# Altium project ReRAM_Board.PrjPcb
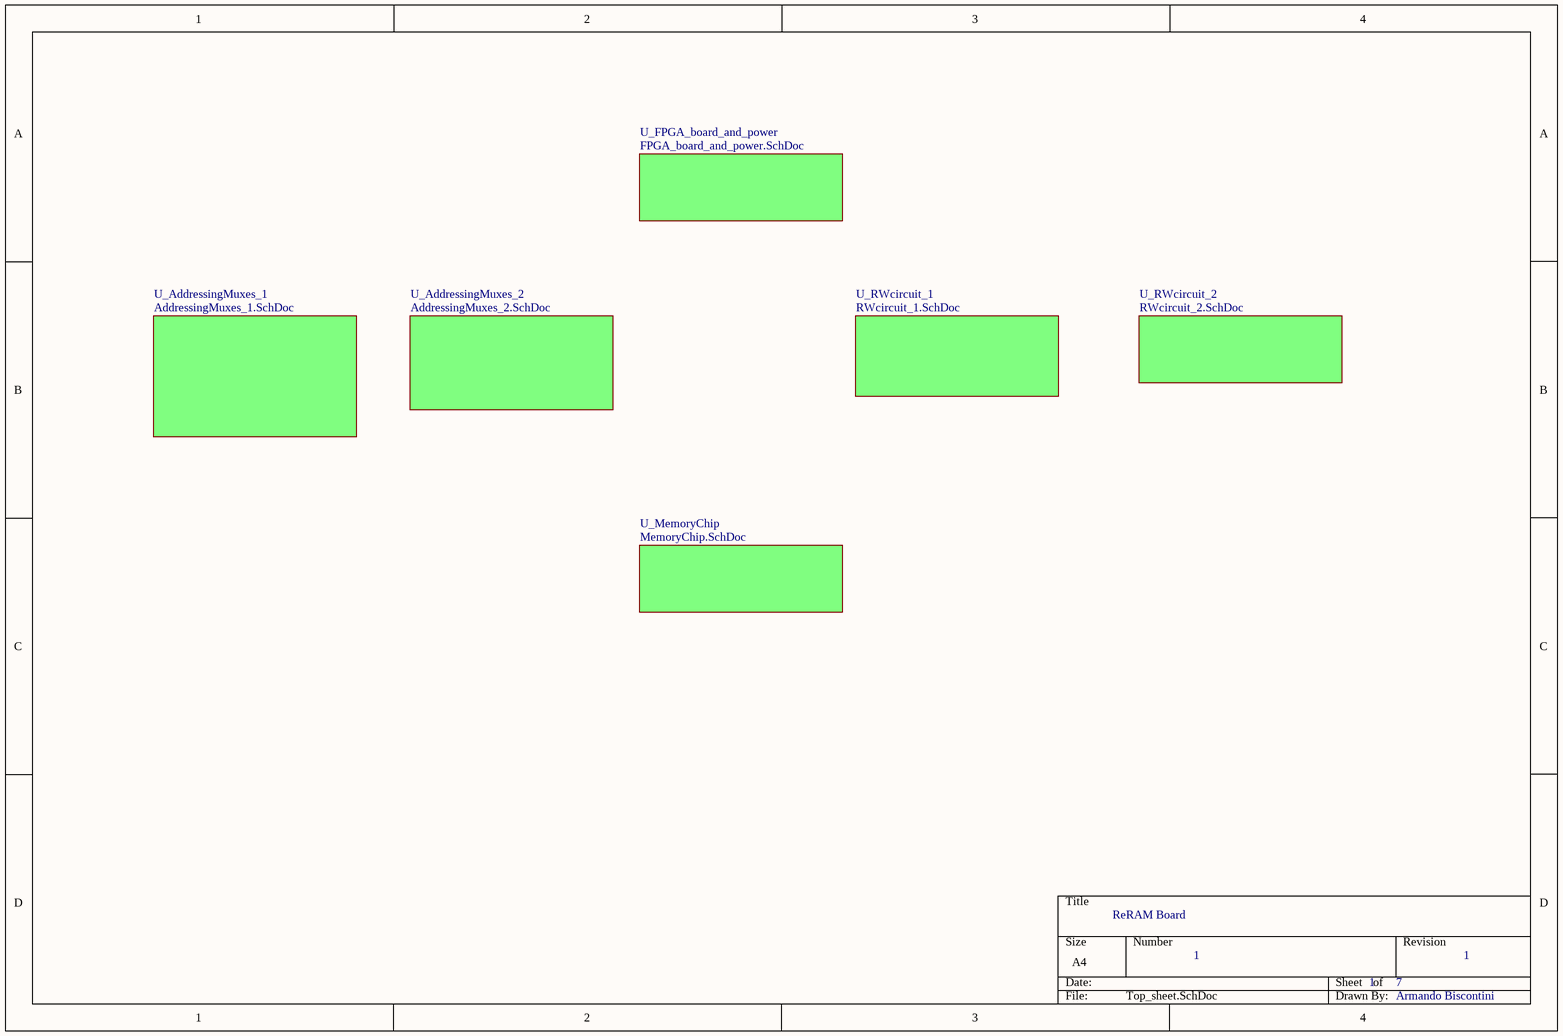
[diagram p0: Top_sheet.SchDoc]
7 sheets, 123 parts. Net scope: flat (ports and power ports of the same name join across sheets).
Board file: PCB1.PcbDoc
Sheets:
  Top_sheet.SchDoc
    U_FPGA_board_and_power = FPGA_board_and_power.SchDoc
    U_AddressingMuxes_1 = AddressingMuxes_1.SchDoc
    U_AddressingMuxes_2 = AddressingMuxes_2.SchDoc
    U_RWcircuit_1 = RWcircuit_1.SchDoc
    U_MemoryChip = MemoryChip.SchDoc
    U_RWcircuit_2 = RWcircuit_2.SchDoc

## Sheet Top_sheet.SchDoc
size A4

### Sub-sheets
U_AddressingMuxes_1 = AddressingMuxes_1.SchDoc: no entries
U_AddressingMuxes_2 = AddressingMuxes_2.SchDoc: no entries
U_FPGA_board_and_power = FPGA_board_and_power.SchDoc: no entries
U_MemoryChip = MemoryChip.SchDoc: no entries
U_RWcircuit_1 = RWcircuit_1.SchDoc: no entries
U_RWcircuit_2 = RWcircuit_2.SchDoc: no entries

### Notes on the sheet
- ReRAM Board
- 1
- 7
- Armando Biscontini

## Sheet FPGA_board_and_power.SchDoc
size A4
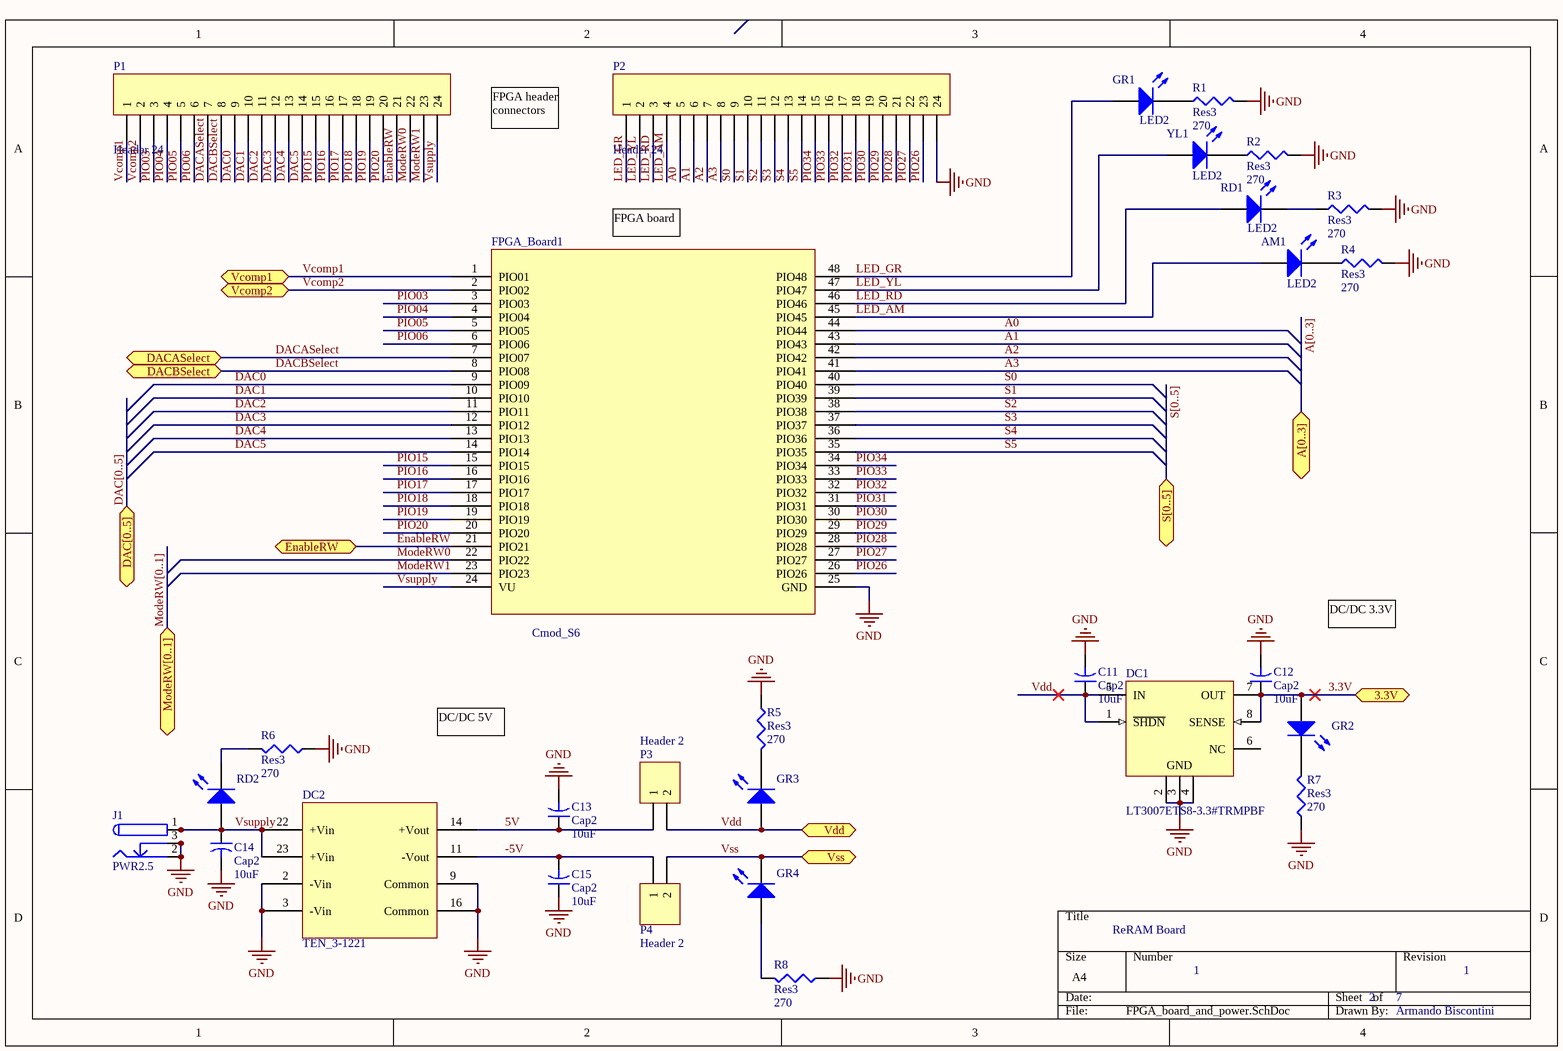
[diagram p1: FPGA_board_and_power.SchDoc]

### Parts
AM1  LED2  [3.2X1.6X1.1]
C11  Cap2  value 10uF  [CAPR5-4X5]
C12  Cap2  value 10uF  [CAPR5-4X5]
C13  Cap2  value 10uF  [CAPR5-4X5]
C14  Cap2  value 10uF  [CAPR5-4X5]
C15  Cap2  value 10uF  [CAPR5-4X5]
DC1  LT3007ETS8-3.3#TRMPBF  [LT-TS8-8-TSOT-23_V]
DC2  TEN_3-1221  [TEN_3-1221]
FPGA_Board1  Cmod_S6  [Cmod_S6_double_conn]
GR1  LED2  [3.2X1.6X1.1]
GR2  (no value)  [3.2X1.6X1.1]
GR3  (no value)  [3.2X1.6X1.1]
GR4  (no value)  [3.2X1.6X1.1]
J1  PWR2.5  [KLD-0202]
P1  Header 24  [HDR1X24]
P2  Header 24  [HDR1X24]
P3  Header 2  [HDR1X2]
P4  Header 2  [HDR1X2]
R1  Res3  value 270  [J1-0603]
R2  Res3  value 270  [J1-0603]
R3  Res3  value 270  [J1-0603]
R4  Res3  value 270  [J1-0603]
R5  Res3  value 270  [J1-0603]
R6  Res3  value 270  [J1-0603]
R7  Res3  value 270  [J1-0603]
R8  Res3  value 270  [J1-0603]
RD1  LED2  [3.2X1.6X1.1]
RD2  (no value)  [3.2X1.6X1.1]
YL1  LED2  [3.2X1.6X1.1]

### Ports
3.3V, A[0..3], DAC[0..5], DACASelect, DACBSelect, EnableRW, ModeRW[0..1], S[0..5], Vcomp1, Vcomp2, Vdd, Vss

### Nets
GND: C11.2 C12.2 C13.2 C14.2 C15.1 DC1.2(GND) DC1.3(GND) DC1.4(GND) DC2.2(-Vin) DC2.3(-Vin) DC2.9(Common) DC2.16(Common) FPGA_Board1.25(GND) J1.2 J1.2A J1.2B J1.3 J1.3A J1.3B P2.24 R1.1 R2.1 R3.1 R4.1 R5.2 R6.2 R7.2 R8.2
3.3V: C12.1 DC1.7(OUT) DC1.8(SENSE) GR2.1(A) ; port 3.3V
5V: C13.1 DC2.14(+Vout) P3.1
-5V: C15.2 DC2.11(-Vout) P4.1
A0: FPGA_Board1.44(PIO44) P2.5
A1: FPGA_Board1.43(PIO43) P2.6
A2: FPGA_Board1.42(PIO42) P2.7
A3: FPGA_Board1.41(PIO41) P2.8
DAC0: FPGA_Board1.9(PIO09) P1.9
DAC1: FPGA_Board1.10(PIO10) P1.10
DAC2: FPGA_Board1.11(PIO11) P1.11
DAC3: FPGA_Board1.12(PIO12) P1.12
DAC4: FPGA_Board1.13(PIO13) P1.13
DAC5: FPGA_Board1.14(PIO14) P1.14
DACASelect: FPGA_Board1.7(PIO07) P1.7 ; port DACASelect
DACBSelect: FPGA_Board1.8(PIO08) P1.8 ; port DACBSelect
EnableRW: FPGA_Board1.21(PIO21) P1.21 ; port EnableRW
LED_AM: AM1.1(A) FPGA_Board1.45(PIO45) P2.4
LED_GR: FPGA_Board1.48(PIO48) GR1.1(A) P2.1
LED_RD: FPGA_Board1.46(PIO46) P2.3 RD1.1(A)
LED_YL: FPGA_Board1.47(PIO47) P2.2 YL1.1(A)
ModeRW0: FPGA_Board1.22(PIO22) P1.22
ModeRW1: FPGA_Board1.23(PIO23) P1.23
PIO03: FPGA_Board1.3(PIO03) P1.3
PIO04: FPGA_Board1.4(PIO04) P1.4
PIO05: FPGA_Board1.5(PIO05) P1.5
PIO06: FPGA_Board1.6(PIO06) P1.6
PIO15: FPGA_Board1.15(PIO15) P1.15
PIO16: FPGA_Board1.16(PIO16) P1.16
PIO17: FPGA_Board1.17(PIO17) P1.17
PIO18: FPGA_Board1.18(PIO18) P1.18
PIO19: FPGA_Board1.19(PIO19) P1.19
PIO20: FPGA_Board1.20(PIO20) P1.20
PIO26: FPGA_Board1.26(PIO26) P2.23
PIO27: FPGA_Board1.27(PIO27) P2.22
PIO28: FPGA_Board1.28(PIO28) P2.21
PIO29: FPGA_Board1.29(PIO29) P2.20
PIO30: FPGA_Board1.30(PIO30) P2.19
PIO31: FPGA_Board1.31(PIO31) P2.18
PIO32: FPGA_Board1.32(PIO32) P2.17
PIO33: FPGA_Board1.33(PIO33) P2.16
PIO34: FPGA_Board1.34(PIO34) P2.15
S0: FPGA_Board1.40(PIO40) P2.9
S1: FPGA_Board1.39(PIO39) P2.10
S2: FPGA_Board1.38(PIO38) P2.11
S3: FPGA_Board1.37(PIO37) P2.12
S4: FPGA_Board1.36(PIO36) P2.13
S5: FPGA_Board1.35(PIO35) P2.14
Vcomp1: FPGA_Board1.1(PIO01) P1.1 ; port Vcomp1
Vcomp2: FPGA_Board1.2(PIO02) P1.2 ; port Vcomp2
Vdd: C11.1 DC1.1(~{SHDN}) DC1.5(IN) GR3.1(A) P3.2 ; port Vdd
Vss: GR4.2(K) P4.2 ; port Vss
Vsupply: C14.1 DC2.22(+Vin) DC2.23(+Vin) FPGA_Board1.24(VU) J1.1 J1.1A J1.1B P1.24 RD2.1(A)
NetAM1_2: AM1.2(K) R4.2
NetGR1_2: GR1.2(K) R1.2
NetGR2_2: GR2.2(K) R7.1
NetGR3_2: GR3.2(K) R5.1
NetGR4_1: GR4.1(A) R8.1
NetR2_2: R2.2 YL1.2(K)
NetR3_2: R3.2 RD1.2(K)
NetR6_1: R6.1 RD2.2(K)

Not connected (* = marked no-connect by the designer): DC1 6(NC)

### Buses and harness runs
bus A[0..3] = port A[0..3]
bus DAC[0..5] = port DAC[0..5]
bus ModeRW[0..1] = port ModeRW[0..1]
bus S[0..5] = port S[0..5]

### Notes on the sheet
- FPGA header connectors
- (near FPGA_Board1) FPGA board
- DC/DC 3.3V
- DC/DC 5V
- ReRAM Board
- 1
- 2
- 7
- Armando Biscontini

### Library data of the parts
AM1 GR1-GR4 RD1 RD2 YL1 = LED2: Typical RED, GREEN, YELLOW, AMBER GaAs LED; Published: 8-Jun-2000; LatestRevisionDate: 17-Jul-2002; LatestRevisionNote: Re-released for DXP Platform.; PackageVersion: Feb-2002; PackageReference: 3.2X1.6X1.1; Publisher: Altium Limited; PackageDescription: SM LED; 2 Flat Leads
C11-C15 = Cap2: Capacitor; Published: 23-Sep-2002; PackageReference: CAPR5-4X5; Publisher: Altium Limited; PackageDescription: Capacitor; 2 Leads
DC1 = LT3007ETS8-3.3#TRMPBF: 3 uA IQ, 20 mA, Low Dropout Fault Tolerant Linear Regulator, 2 to 45 V Vin, 3.3 V Vout, 8-pin SOT23 (TS8-8), -40 to 125 degC, Pb-Free, Mini Tape and Reel; Manufacturer: Linear Technology; Discrete Pass Element: no; Dropout Voltage(V): 0.3; Iout(mA): 20; Isupply(mA): 0.003; Noise(uV): 92; Number of Outputs: 1; Output Voltage: 3.3 V; PSRR(dB): 59; Vin Max(V): 45; Vin Min(V): 2; PackageVersion: Rev. A, 08/2010; PackageReference: TS8-8; PackageDescription: 8-Pin Plastic TSOT-23, Body 2.9 x 1.63 mm, Pitch 0.65 mm; Supplier 1: Digi-Key; Supplier Part Number 1: LT3007ETS8-3.3#TRMPBF-ND; Supplier 2: Newark; Supplier Part Number 2: 71W8541; Packing: Mini Tape and Reel; RoHS: TRUE; Shutdown Current(uA): 1; Mounting Technology: Surface Mount; Code_JEDEC: MO-193; PartNumber: LT3007ETS8-3.3#TRMPBF; ComponentLink1Description: Manufacturer URL; ComponentLink1URL: http://www.linear.com/; ComponentLink2Description: Datasheet; ComponentLink2URL: http://cds.linear.com/docs/en/datasheet/3007f.pdf; ComponentLink3Description: Package Specification; ComponentLink3URL: http://cds.linear.com/docs/en/packaging/SOT_8_05-08-1637.pdf
DC2 = TEN_3-1221: Tracopower TEN 3-1221
FPGA_Board1 = Cmod_S6: Digilent Cmod S6 Board
J1 = PWR2.5: Low Voltage Power Supply Connector; Published: 17-Dec-2003; DatasheetDocument: 09-May-2002; Publisher: Altium Limited; ComponentLink1Description: Manufacturer Link; ComponentLink1URL: http://domino.kycon.com/internet/Products.html
P1 P2 = Header 24: Header, 24-Pin; LatestRevisionDate: 17-Jul-2002; LatestRevisionNote: Re-released for DXP Platform.; Publisher: Altium Limited
P3 P4 = Header 2: Header, 2-Pin; LatestRevisionDate: 17-Jul-2002; LatestRevisionNote: Re-released for DXP Platform.; Publisher: Altium Limited
R1-R8 = Res3: Resistor; Published: 8-Jun-2000; LatestRevisionDate: 29-May-2009; LatestRevisionNote: IPC-7351 Footprint Added.; PackageReference: J1-0603; Publisher: Altium Limited; PackageDescription: Chip Resistor

## Sheet AddressingMuxes_1.SchDoc
size A4
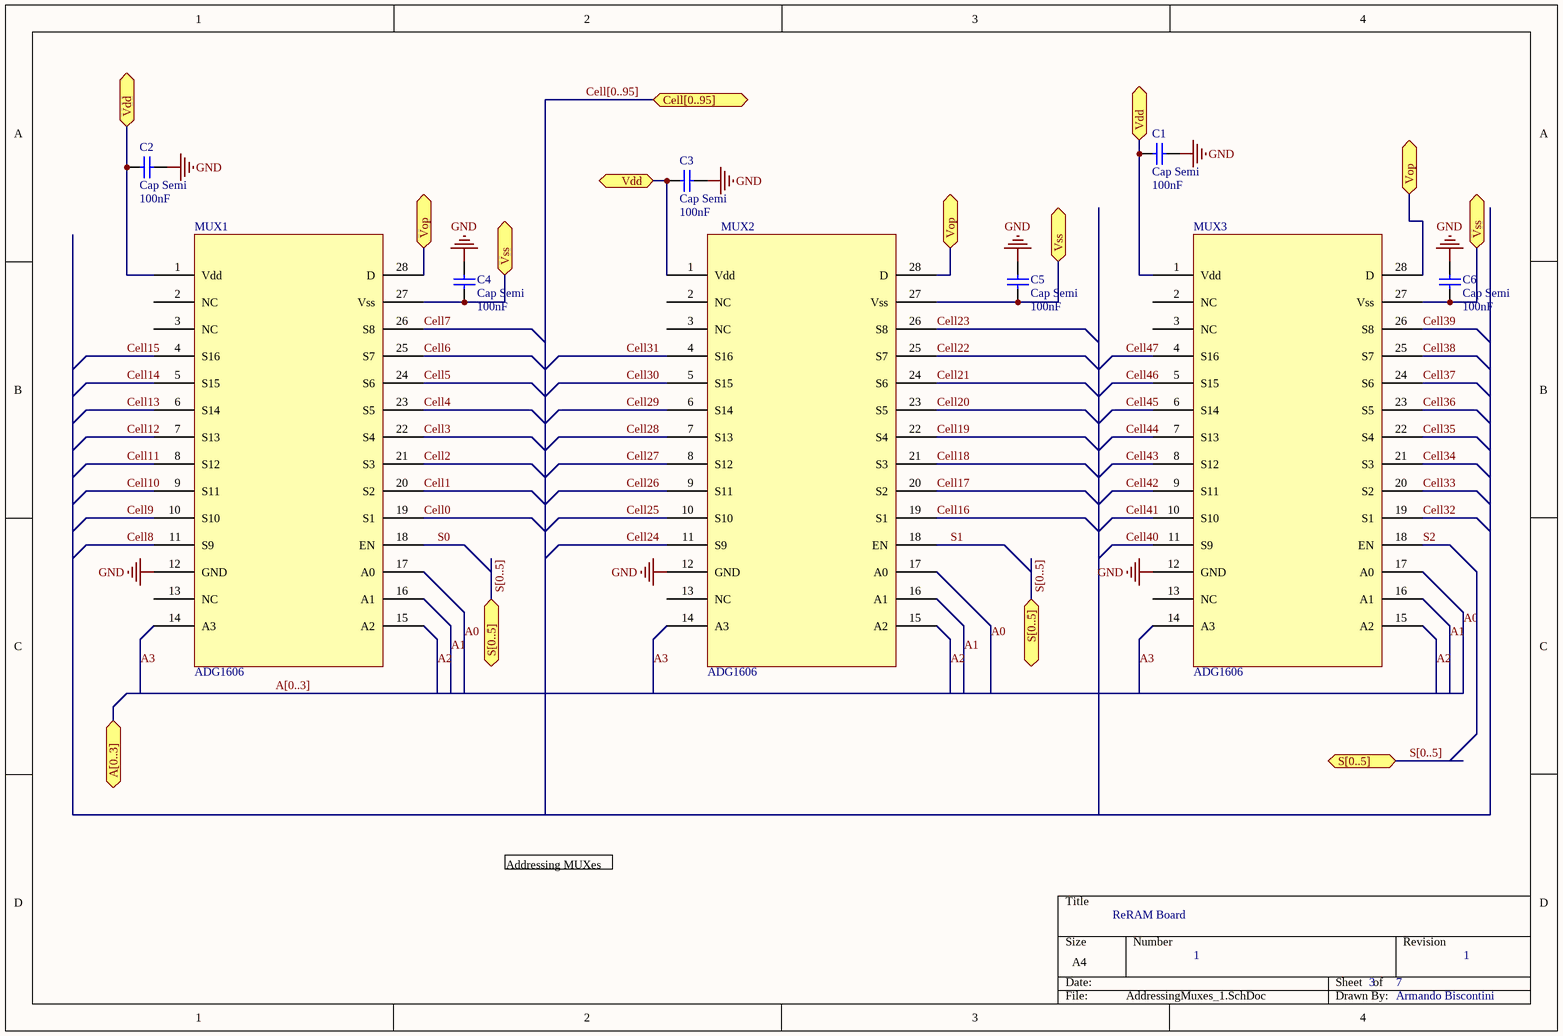
[diagram p2: AddressingMuxes_1.SchDoc]

### Parts
C1  Cap Semi  value 100nF  [C1206]
C2  Cap Semi  value 100nF  [C1206]
C3  Cap Semi  value 100nF  [C1206]
C4  Cap Semi  value 100nF  [C1206]
C5  Cap Semi  value 100nF  [C1206]
C6  Cap Semi  value 100nF  [C1206]
MUX1  ADG1606  [TSOP65P640X120-28N]
MUX2  ADG1606  [TSOP65P640X120-28N]
MUX3  ADG1606  [TSOP65P640X120-28N]

### Ports
A[0..3], Cell[0..95], S[0..5], Vdd, Vop, Vss

### Nets
GND: C1.1 C2.2 C3.2 C4.2 C5.2 C6.1 MUX1.12(GND) MUX2.12(GND) MUX3.12(GND)
A0: MUX1.17(A0) MUX2.17(A0) MUX3.17(A0)
A1: MUX1.16(A1) MUX2.16(A1) MUX3.16(A1)
A2: MUX1.15(A2) MUX2.15(A2) MUX3.15(A2)
A3: MUX1.14(A3) MUX2.14(A3) MUX3.14(A3)
Cell0: MUX1.19(S1)
Cell1: MUX1.20(S2)
Cell2: MUX1.21(S3)
Cell3: MUX1.22(S4)
Cell4: MUX1.23(S5)
Cell5: MUX1.24(S6)
Cell6: MUX1.25(S7)
Cell7: MUX1.26(S8)
Cell8: MUX1.11(S9)
Cell9: MUX1.10(S10)
Cell10: MUX1.9(S11)
Cell11: MUX1.8(S12)
Cell12: MUX1.7(S13)
Cell13: MUX1.6(S14)
Cell14: MUX1.5(S15)
Cell15: MUX1.4(S16)
Cell16: MUX2.19(S1)
Cell17: MUX2.20(S2)
Cell18: MUX2.21(S3)
Cell19: MUX2.22(S4)
Cell20: MUX2.23(S5)
Cell21: MUX2.24(S6)
Cell22: MUX2.25(S7)
Cell23: MUX2.26(S8)
Cell24: MUX2.11(S9)
Cell25: MUX2.10(S10)
Cell26: MUX2.9(S11)
Cell27: MUX2.8(S12)
Cell28: MUX2.7(S13)
Cell29: MUX2.6(S14)
Cell30: MUX2.5(S15)
Cell31: MUX2.4(S16)
Cell32: MUX3.19(S1)
Cell33: MUX3.20(S2)
Cell34: MUX3.21(S3)
Cell35: MUX3.22(S4)
Cell36: MUX3.23(S5)
Cell37: MUX3.24(S6)
Cell38: MUX3.25(S7)
Cell39: MUX3.26(S8)
Cell40: MUX3.11(S9)
Cell41: MUX3.10(S10)
Cell42: MUX3.9(S11)
Cell43: MUX3.8(S12)
Cell44: MUX3.7(S13)
Cell45: MUX3.6(S14)
Cell46: MUX3.5(S15)
Cell47: MUX3.4(S16)
S0: MUX1.18(EN)
S1: MUX2.18(EN)
S2: MUX3.18(EN)
Vdd: C1.2 C2.1 C3.1 MUX1.1(Vdd) MUX2.1(Vdd) MUX3.1(Vdd) ; port Vdd
Vss: C4.1 C5.1 C6.2 MUX1.27(Vss) MUX2.27(Vss) MUX3.27(Vss) ; port Vss
NetMUX1_28: MUX1.28(D) MUX2.28(D) MUX3.28(D) ; port Vop

Not connected (* = marked no-connect by the designer): MUX1 2(NC) 3(NC) 13(NC); MUX2 2(NC) 3(NC) 13(NC); MUX3 2(NC) 3(NC) 13(NC)

### Buses and harness runs
bus A[0..3] = port A[0..3]
bus Cell[0..95] = port Cell[0..95]
bus S[0..5] = port S[0..5]

### Notes on the sheet
- Addressing MUXes
- ReRAM Board
- 1
- 3
- 7
- Armando Biscontini

### Library data of the parts
C1-C6 = Cap Semi: Capacitor (Semiconductor SIM Model); Published: 8-Jun-2000; LatestRevisionDate: 29-May-2009; LatestRevisionNote: IPC-7351 Footprint Added.; PackageReference: C1206; Publisher: Altium Limited; PackageDescription: Chip Capacitor
MUX1-MUX3 = ADG1606: Analog Devices ADG1606

## Sheet AddressingMuxes_2.SchDoc
size A4
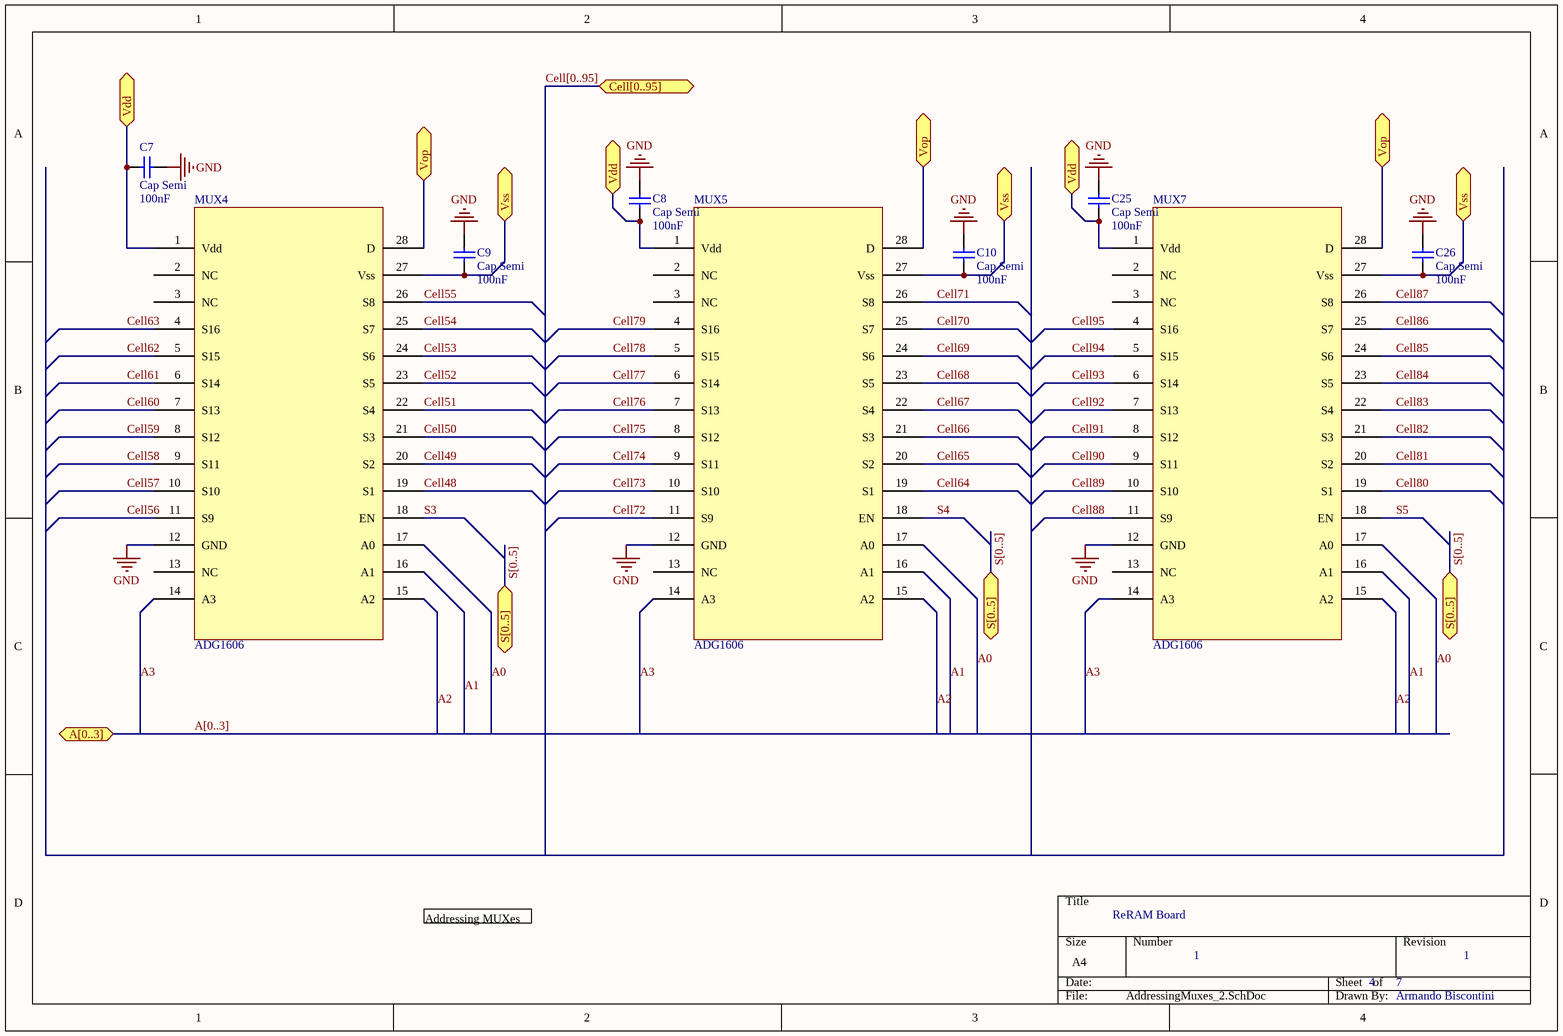
[diagram p3: AddressingMuxes_2.SchDoc]

### Parts
C7  Cap Semi  value 100nF  [C1206]
C8  Cap Semi  value 100nF  [C1206]
C9  Cap Semi  value 100nF  [C1206]
C10  Cap Semi  value 100nF  [C1206]
C25  Cap Semi  value 100nF  [C1206]
C26  Cap Semi  value 100nF  [C1206]
MUX4  ADG1606  [TSOP65P640X120-28N]
MUX5  ADG1606  [TSOP65P640X120-28N]
MUX7  ADG1606  [TSOP65P640X120-28N]

### Ports
A[0..3], Cell[0..95], S[0..5], Vdd, Vop, Vss

### Nets
GND: C7.2 C8.1 C9.1 C10.1 C25.1 C26.1 MUX4.12(GND) MUX5.12(GND) MUX7.12(GND)
A0: MUX4.17(A0) MUX5.17(A0) MUX7.17(A0)
A1: MUX4.16(A1) MUX5.16(A1) MUX7.16(A1)
A2: MUX4.15(A2) MUX5.15(A2) MUX7.15(A2)
A3: MUX4.14(A3) MUX5.14(A3) MUX7.14(A3)
Cell48: MUX4.19(S1)
Cell49: MUX4.20(S2)
Cell50: MUX4.21(S3)
Cell51: MUX4.22(S4)
Cell52: MUX4.23(S5)
Cell53: MUX4.24(S6)
Cell54: MUX4.25(S7)
Cell55: MUX4.26(S8)
Cell56: MUX4.11(S9)
Cell57: MUX4.10(S10)
Cell58: MUX4.9(S11)
Cell59: MUX4.8(S12)
Cell60: MUX4.7(S13)
Cell61: MUX4.6(S14)
Cell62: MUX4.5(S15)
Cell63: MUX4.4(S16)
Cell64: MUX5.19(S1)
Cell65: MUX5.20(S2)
Cell66: MUX5.21(S3)
Cell67: MUX5.22(S4)
Cell68: MUX5.23(S5)
Cell69: MUX5.24(S6)
Cell70: MUX5.25(S7)
Cell71: MUX5.26(S8)
Cell72: MUX5.11(S9)
Cell73: MUX5.10(S10)
Cell74: MUX5.9(S11)
Cell75: MUX5.8(S12)
Cell76: MUX5.7(S13)
Cell77: MUX5.6(S14)
Cell78: MUX5.5(S15)
Cell79: MUX5.4(S16)
Cell80: MUX7.19(S1)
Cell81: MUX7.20(S2)
Cell82: MUX7.21(S3)
Cell83: MUX7.22(S4)
Cell84: MUX7.23(S5)
Cell85: MUX7.24(S6)
Cell86: MUX7.25(S7)
Cell87: MUX7.26(S8)
Cell88: MUX7.11(S9)
Cell89: MUX7.10(S10)
Cell90: MUX7.9(S11)
Cell91: MUX7.8(S12)
Cell92: MUX7.7(S13)
Cell93: MUX7.6(S14)
Cell94: MUX7.5(S15)
Cell95: MUX7.4(S16)
S3: MUX4.18(EN)
S4: MUX5.18(EN)
S5: MUX7.18(EN)
Vdd: C7.1 C8.2 C25.2 MUX4.1(Vdd) MUX5.1(Vdd) MUX7.1(Vdd) ; port Vdd
Vss: C9.2 C10.2 C26.2 MUX4.27(Vss) MUX5.27(Vss) MUX7.27(Vss) ; port Vss
NetMUX1_28: MUX4.28(D) MUX5.28(D) MUX7.28(D) ; port Vop

Not connected (* = marked no-connect by the designer): MUX4 2(NC) 3(NC) 13(NC); MUX5 2(NC) 3(NC) 13(NC); MUX7 2(NC) 3(NC) 13(NC)

### Buses and harness runs
bus A[0..3] = port A[0..3]
bus Cell[0..95] = port Cell[0..95]
bus S[0..5] = port S[0..5]

### Notes on the sheet
- Addressing MUXes
- ReRAM Board
- 1
- 4
- 7
- Armando Biscontini

### Library data of the parts
C7-C10 C25 C26 = Cap Semi: Capacitor (Semiconductor SIM Model); Published: 8-Jun-2000; LatestRevisionDate: 29-May-2009; LatestRevisionNote: IPC-7351 Footprint Added.; PackageReference: C1206; Publisher: Altium Limited; PackageDescription: Chip Capacitor
MUX4 MUX5 MUX7 = ADG1606: Analog Devices ADG1606

## Sheet RWcircuit_1.SchDoc
size A4
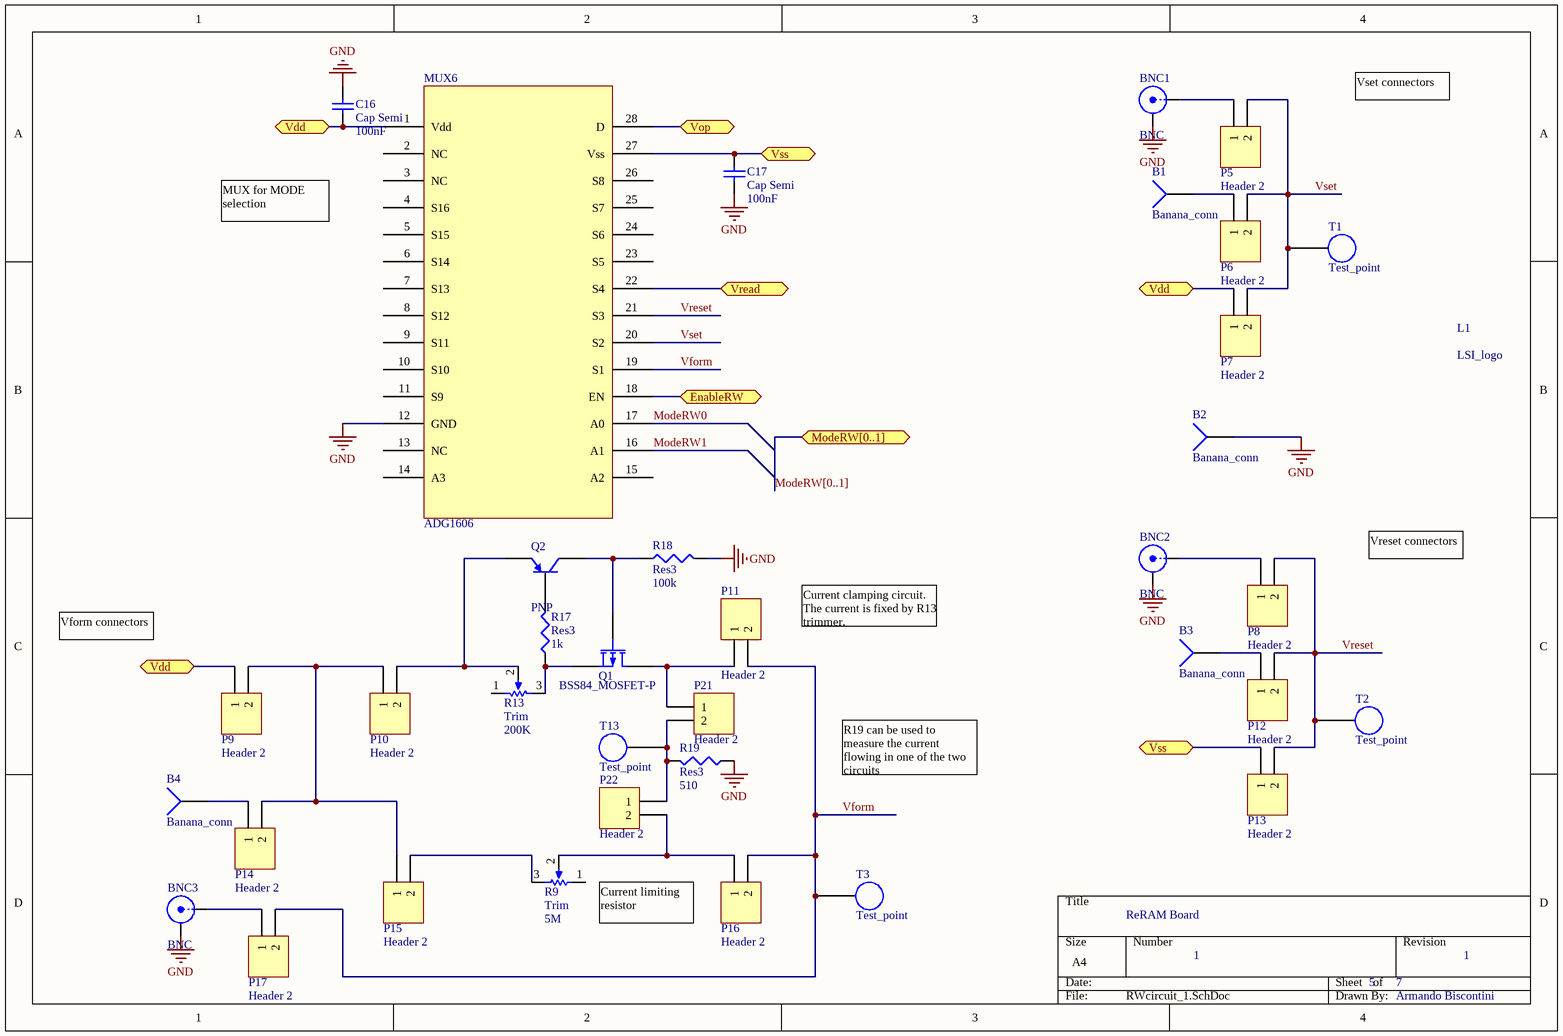
[diagram p4: RWcircuit_1.SchDoc]

### Parts
B1  Banana_conn  [Banana_conn_4mm]
B2  Banana_conn  [Banana_conn_4mm]
B3  Banana_conn  [Banana_conn_4mm]
B4  Banana_conn  [Banana_conn_4mm]
BNC1  BNC  [BNC_RA CON]
BNC2  BNC  [BNC_RA CON]
BNC3  BNC  [BNC_RA CON]
C16  Cap Semi  value 100nF  [C1206]
C17  Cap Semi  value 100nF  [C1206]
L1  LSI_logo  [LSI_logo]
MUX6  ADG1606  [TSOP65P640X120-28N]
P5  Header 2  [HDR1X2]
P6  Header 2  [HDR1X2]
P7  Header 2  [HDR1X2]
P8  Header 2  [HDR1X2]
P9  Header 2  [HDR1X2]
P10  Header 2  [HDR1X2]
P11  Header 2  [HDR1X2]
P12  Header 2  [HDR1X2]
P13  Header 2  [HDR1X2]
P14  Header 2  [HDR1X2]
P15  Header 2  [HDR1X2]
P16  Header 2  [HDR1X2]
P17  Header 2  [HDR1X2]
P21  Header 2  [HDR1X2]
P22  Header 2  [HDR1X2]
Q1  BSS84_MOSFET-P  [BSS84_MOSFET-P]
Q2  PNP  [MMBT5087_PNP]
R9  Trim  value 5M  [Trim_Bourns_3266X]
R13  Trim  value 200K  [Trim_Bourns_3266W]
R17  Res3  value 1k  [J1-0603]
R18  Res3  value 100k  [J1-0603]
R19  Res3  value 510  [J1-0603]
T1  Test_point  [Test_point_1.32mm]
T2  Test_point  [Test_point_1.32mm]
T3  Test_point  [Test_point_1.32mm]
T13  Test_point  [Test_point_1.32mm]

### Ports
EnableRW, ModeRW[0..1], Vdd, Vop, Vread, Vss

### Nets
GND: B2.1 BNC1.2(Y) BNC2.2(Y) BNC3.2(Y) C16.2 C17.1 MUX6.12(GND) R18.2 R19.1
EnableRW: MUX6.18(EN) ; port EnableRW
ModeRW0: MUX6.17(A0)
ModeRW1: MUX6.16(A1)
Vdd: C16.1 MUX6.1(Vdd) P7.1 P9.1 ; port Vdd
Vform: MUX6.19(S1) P11.2 P16.2 P17.2 T3.1
Vreset: MUX6.21(S3) P8.2 P12.2 P13.2 T2.1
Vset: MUX6.20(S2) P5.2 P6.2 P7.2 T1.1
Vss: C17.2 MUX6.27(Vss) P13.1 ; port Vss
NetB1_1: B1.1 P6.1
NetB3_1: B3.1 P12.1
NetB4_1: B4.1 P14.1
NetBNC1_1: BNC1.1(X) P5.1
NetBNC2_1: BNC2.1(X) P8.1
NetBNC3_1: BNC3.1(X) P17.1
NetMUX1_28: MUX6.28(D) ; port Vop
NetMUX6_22: MUX6.22(S4) ; port Vread
NetP9_2: P9.2 P10.1 P14.2 P15.1
NetP10_2: P10.2 Q2.3(E) R13.2(TAP)
NetP11_1: P11.1 P21.1 Q1.3(D)
NetP15_2: P15.2 R9.3(BOT)
NetP16_1: P16.1 P22.2 R9.2(TAP)
NetP21_2: P21.2 P22.1 R19.2 T13.1
NetQ1_1: Q1.1(G) Q2.1(C) R18.1
NetQ1_2: Q1.2(S) R13.3(BOT) R17.1
NetQ2_2: Q2.2(B) R17.2

Not connected (* = marked no-connect by the designer): MUX6 2(NC) 3(NC) 4(S16) 5(S15) 6(S14) 7(S13) 8(S12) 9(S11) 10(S10) 11(S9) 13(NC) 14(A3) 15(A2) 23(S5) 24(S6) 25(S7) 26(S8); R9 1(TOP); R13 1(TOP)

### Buses and harness runs
bus ModeRW[0..1] = port ModeRW[0..1]

### Notes on the sheet
- Vset connectors
- MUX for MODE selection
- Vreset connectors
- Vform connectors
- Current clamping circuit.
  The current is fixed by R13 trimmer.
- R19 can be used to measure the current flowing in one of the two circuits
- Current limiting resistor
- ReRAM Board
- 1
- 5
- 7
- Armando Biscontini

### Library data of the parts
B1-B4 = Banana_conn_4mm: Multicomp banana connector 4mm pcb through hole
BNC1-BNC3 = BNC: BNC Elbow Connector; LatestRevisionDate: 17-Jul-2002; LatestRevisionNote: Re-released for DXP Platform.; Publisher: Altium Limited
C16 C17 = Cap Semi: Capacitor (Semiconductor SIM Model); Published: 8-Jun-2000; LatestRevisionDate: 29-May-2009; LatestRevisionNote: IPC-7351 Footprint Added.; PackageReference: C1206; Publisher: Altium Limited; PackageDescription: Chip Capacitor
L1 = LSI_logo: LSI logo
MUX6 = ADG1606: Analog Devices ADG1606
P5-P17 P21 P22 = Header 2: Header, 2-Pin; LatestRevisionDate: 17-Jul-2002; LatestRevisionNote: Re-released for DXP Platform.; Publisher: Altium Limited
Q1 = BSS84_MOSFET-P: BSS84 P-Channel MOSFET; Published: 8-Jun-2000; LatestRevisionDate: 17-Jul-2002; LatestRevisionNote: Re-released for DXP Platform.; PackageVersion: 1995/1996; PackageReference: E3; Publisher: Altium Limited; PackageDescription: TO, Flat Index; 3 In-Line, Axial Leads; Body Dia. 4.6mm; Lead Dia. 0.5 mm (max)
Q2 = MMBT5087_PNP: MMBT5087 PNP Bipolar Transistor; Published: 8-Jun-2000; LatestRevisionDate: 29-May-2009; LatestRevisionNote: IPC-7351 Footprint Added.; PackageVersion: Aug-1999; PackageReference: SOT-23B; Publisher: Altium Limited; PackageDescription: 3-Pin SOT-23 Package 0.95 mm Pitch, 2.4 mm Lead Span
R9 = Trim_Bourns_3266X: Trimmer Bourns 3266X; Sim Note: Enter the Resistance value and the set point into parameter fields.; Set Position: 0.5; Published: 8-Jun-2000; LatestRevisionDate: 17-Jul-2002; LatestRevisionNote: Re-released for DXP Platform.; PackageReference: VR5; Publisher: Altium Limited; PackageDescription: Variable Resistor, Thru-Hole; 3 Leads
R13 = Trim_Bourns_3266W: Trimmer Bourns 3266W; Sim Note: Enter the Resistance value and the set point into parameter fields.; Set Position: 0.5; Published: 8-Jun-2000; LatestRevisionDate: 17-Jul-2002; LatestRevisionNote: Re-released for DXP Platform.; PackageReference: VR5; Publisher: Altium Limited; PackageDescription: Variable Resistor, Thru-Hole; 3 Leads
R17-R19 = Res3: Resistor; Published: 8-Jun-2000; LatestRevisionDate: 29-May-2009; LatestRevisionNote: IPC-7351 Footprint Added.; PackageReference: J1-0603; Publisher: Altium Limited; PackageDescription: Chip Resistor
T1-T3 T13 = Test_point_1.32mm: Test point 1.32mm

## Sheet MemoryChip.SchDoc
size A4
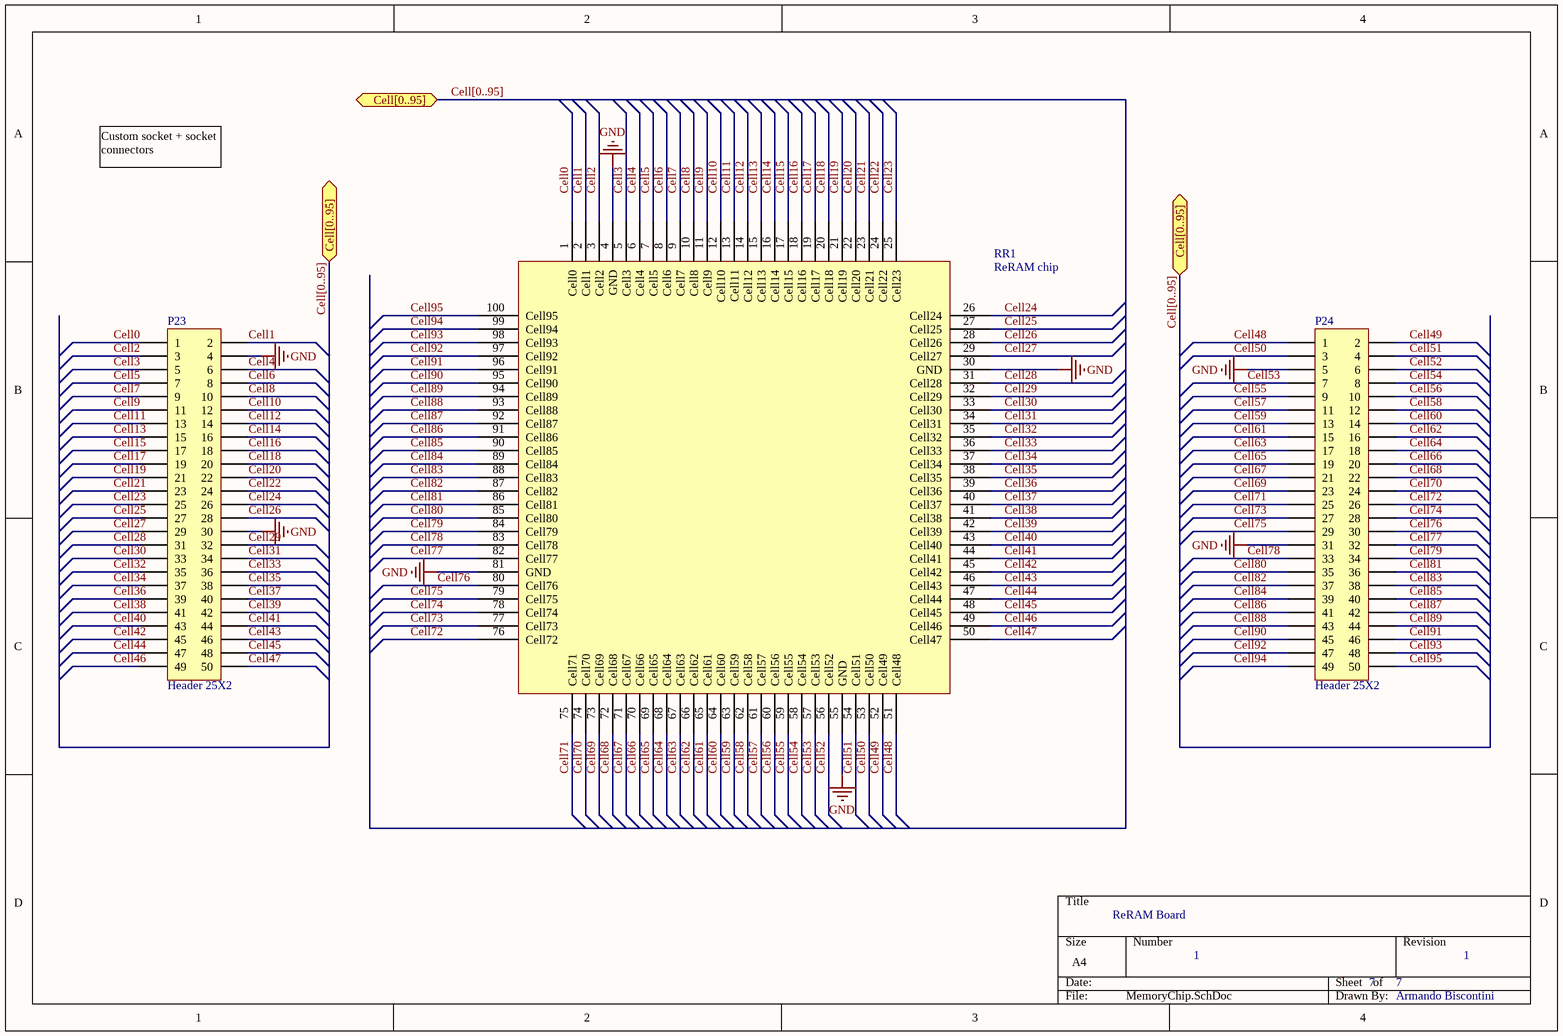
[diagram p5: MemoryChip.SchDoc]

### Parts
P23  Header 25X2  [HDR2X25]
P24  Header 25X2  [HDR2X25]
RR1  ReRAM chip  [LSI-PLLGA100]

### Ports
Cell[0..95]

### Nets
GND: P23.4 P23.30 P24.5 P24.31 RR1.4(GND) RR1.30(GND) RR1.55(GND) RR1.81(GND)
Cell0: P23.1 RR1.1(Cell0)
Cell1: P23.2 RR1.2(Cell1)
Cell2: P23.3 RR1.3(Cell2)
Cell3: P23.5 RR1.5(Cell3)
Cell4: P23.6 RR1.6(Cell4)
Cell5: P23.7 RR1.7(Cell5)
Cell6: P23.8 RR1.8(Cell6)
Cell7: P23.9 RR1.9(Cell7)
Cell8: P23.10 RR1.10(Cell8)
Cell9: P23.11 RR1.11(Cell9)
Cell10: P23.12 RR1.12(Cell10)
Cell11: P23.13 RR1.13(Cell11)
Cell12: P23.14 RR1.14(Cell12)
Cell13: P23.15 RR1.15(Cell13)
Cell14: P23.16 RR1.16(Cell14)
Cell15: P23.17 RR1.17(Cell15)
Cell16: P23.18 RR1.18(Cell16)
Cell17: P23.19 RR1.19(Cell17)
Cell18: P23.20 RR1.20(Cell18)
Cell19: P23.21 RR1.21(Cell19)
Cell20: P23.22 RR1.22(Cell20)
Cell21: P23.23 RR1.23(Cell21)
Cell22: P23.24 RR1.24(Cell22)
Cell23: P23.25 RR1.25(Cell23)
Cell24: P23.26 RR1.26(Cell24)
Cell25: P23.27 RR1.27(Cell25)
Cell26: P23.28 RR1.28(Cell26)
Cell27: P23.29 RR1.29(Cell27)
Cell28: P23.31 RR1.31(Cell28)
Cell29: P23.32 RR1.32(Cell29)
Cell30: P23.33 RR1.33(Cell30)
Cell31: P23.34 RR1.34(Cell31)
Cell32: P23.35 RR1.35(Cell32)
Cell33: P23.36 RR1.36(Cell33)
Cell34: P23.37 RR1.37(Cell34)
Cell35: P23.38 RR1.38(Cell35)
Cell36: P23.39 RR1.39(Cell36)
Cell37: P23.40 RR1.40(Cell37)
Cell38: P23.41 RR1.41(Cell38)
Cell39: P23.42 RR1.42(Cell39)
Cell40: P23.43 RR1.43(Cell40)
Cell41: P23.44 RR1.44(Cell41)
Cell42: P23.45 RR1.45(Cell42)
Cell43: P23.46 RR1.46(Cell43)
Cell44: P23.47 RR1.47(Cell44)
Cell45: P23.48 RR1.48(Cell45)
Cell46: P23.49 RR1.49(Cell46)
Cell47: P23.50 RR1.50(Cell47)
Cell48: P24.1 RR1.51(Cell48)
Cell49: P24.2 RR1.52(Cell49)
Cell50: P24.3 RR1.53(Cell50)
Cell51: P24.4 RR1.54(Cell51)
Cell52: P24.6 RR1.56(Cell52)
Cell53: P24.7 RR1.57(Cell53)
Cell54: P24.8 RR1.58(Cell54)
Cell55: P24.9 RR1.59(Cell55)
Cell56: P24.10 RR1.60(Cell56)
Cell57: P24.11 RR1.61(Cell57)
Cell58: P24.12 RR1.62(Cell58)
Cell59: P24.13 RR1.63(Cell59)
Cell60: P24.14 RR1.64(Cell60)
Cell61: P24.15 RR1.65(Cell61)
Cell62: P24.16 RR1.66(Cell62)
Cell63: P24.17 RR1.67(Cell63)
Cell64: P24.18 RR1.68(Cell64)
Cell65: P24.19 RR1.69(Cell65)
Cell66: P24.20 RR1.70(Cell66)
Cell67: P24.21 RR1.71(Cell67)
Cell68: P24.22 RR1.72(Cell68)
Cell69: P24.23 RR1.73(Cell69)
Cell70: P24.24 RR1.74(Cell70)
Cell71: P24.25 RR1.75(Cell71)
Cell72: P24.26 RR1.76(Cell72)
Cell73: P24.27 RR1.77(Cell73)
Cell74: P24.28 RR1.78(Cell74)
Cell75: P24.29 RR1.79(Cell75)
Cell76: P24.30 RR1.80(Cell76)
Cell77: P24.32 RR1.82(Cell77)
Cell78: P24.33 RR1.83(Cell78)
Cell79: P24.34 RR1.84(Cell79)
Cell80: P24.35 RR1.85(Cell80)
Cell81: P24.36 RR1.86(Cell81)
Cell82: P24.37 RR1.87(Cell82)
Cell83: P24.38 RR1.88(Cell83)
Cell84: P24.39 RR1.89(Cell84)
Cell85: P24.40 RR1.90(Cell85)
Cell86: P24.41 RR1.91(Cell86)
Cell87: P24.42 RR1.92(Cell87)
Cell88: P24.43 RR1.93(Cell88)
Cell89: P24.44 RR1.94(Cell89)
Cell90: P24.45 RR1.95(Cell90)
Cell91: P24.46 RR1.96(Cell91)
Cell92: P24.47 RR1.97(Cell92)
Cell93: P24.48 RR1.98(Cell93)
Cell94: P24.49 RR1.99(Cell94)
Cell95: P24.50 RR1.100(Cell95)

### Buses and harness runs
bus Cell[0..95] = port Cell[0..95]

### Notes on the sheet
- Custom socket + socket connectors
- ReRAM Board
- 1
- 7
- Armando Biscontini

### Library data of the parts
P23 P24 = Header 25X2: Header, 25-Pin, Dual row; LatestRevisionDate: 17-Jul-2002; LatestRevisionNote: Re-released for DXP Platform.; Publisher: Altium Limited
RR1 = ReRAM_LSI-PLLGA100: ReRAM chip on LSI-PLLGA100 custom socket

## Sheet RWcircuit_2.SchDoc
size A4
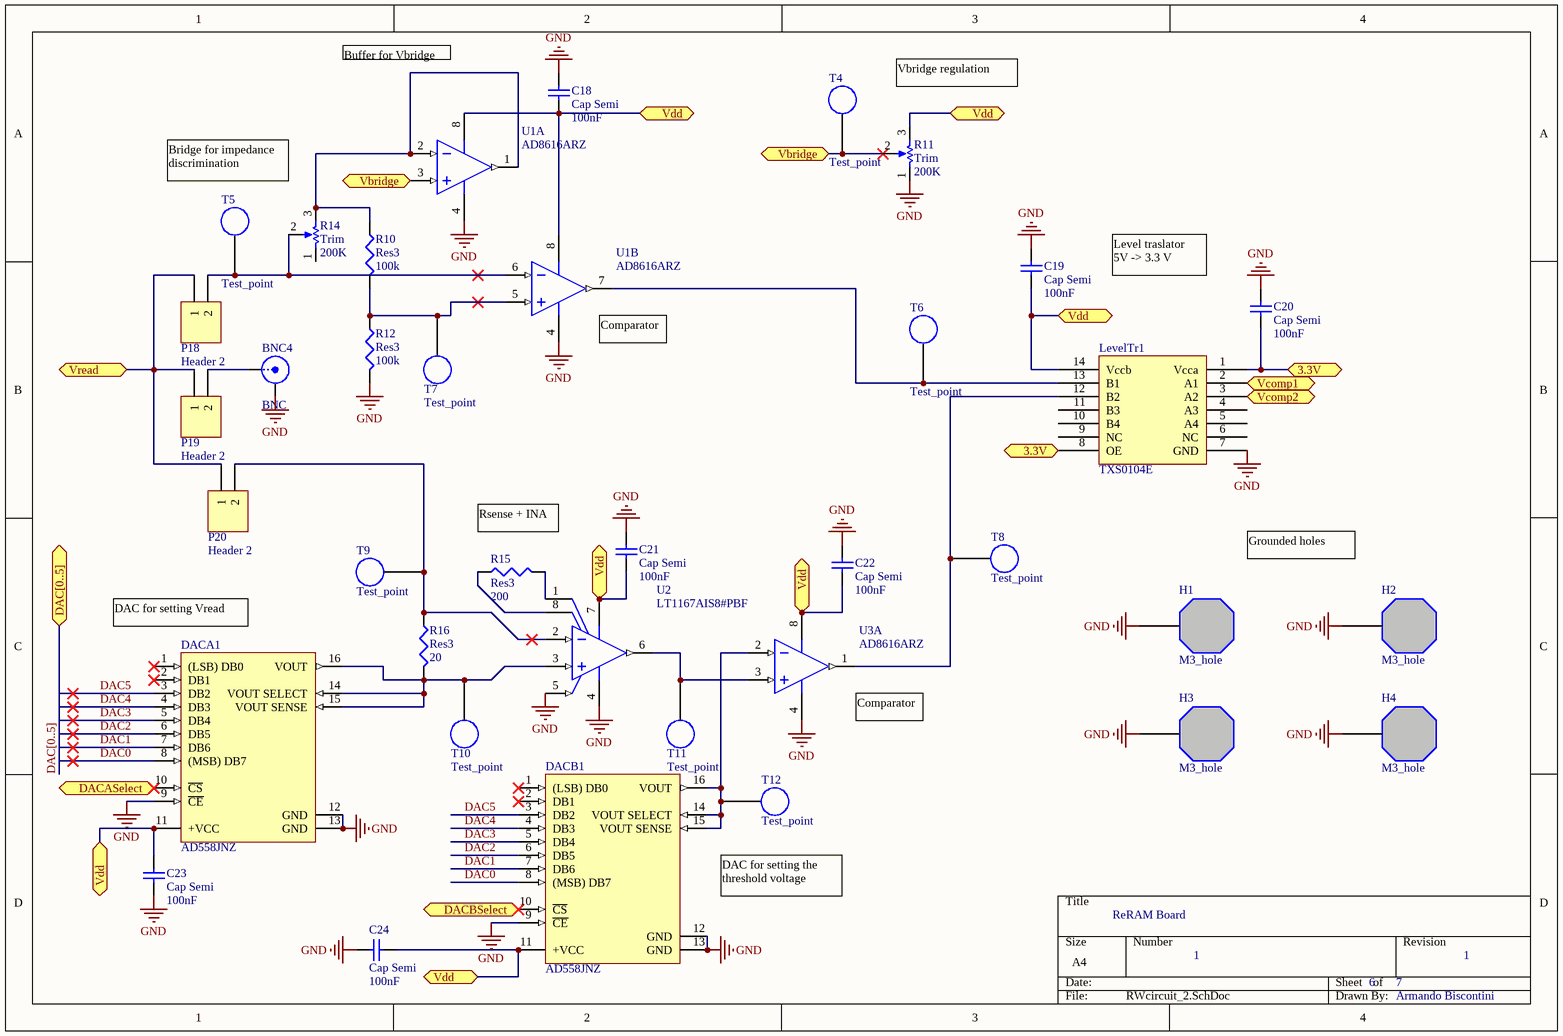
[diagram p6: RWcircuit_2.SchDoc]

### Parts
BNC4  BNC  [BNC_RA CON]
C18  Cap Semi  value 100nF  [C1206]
C19  Cap Semi  value 100nF  [C1206]
C20  Cap Semi  value 100nF  [C1206]
C21  Cap Semi  value 100nF  [C1206]
C22  Cap Semi  value 100nF  [C1206]
C23  Cap Semi  value 100nF  [C1206]
C24  Cap Semi  value 100nF  [C1206]
DACA1  AD558JNZ  [N-16]
DACB1  AD558JNZ  [N-16]
H1  M3_hole  [M3_hole]
H2  M3_hole  [M3_hole]
H3  M3_hole  [M3_hole]
H4  M3_hole  [M3_hole]
LevelTr1  TXS0104E  [SOIC127P600X175-14N]
P18  Header 2  [HDR1X2]
P19  Header 2  [HDR1X2]
P20  Header 2  [HDR1X2]
R10  Res3  value 100k  [J1-0603]
R11  Trim  value 200K  [Trim_Bourns_3266W]
R12  Res3  value 100k  [J1-0603]
R14  Trim  value 200K  [Trim_Bourns_3266W]
R15  Res3  value 200  [J1-0603]
R16  Res3  value 20  [J1-0603]
T4  Test_point  [Test_point_1.32mm]
T5  Test_point  [Test_point_1.32mm]
T6  Test_point  [Test_point_1.32mm]
T7  Test_point  [Test_point_1.32mm]
T8  Test_point  [Test_point_1.32mm]
T9  Test_point  [Test_point_1.32mm]
T10  Test_point  [Test_point_1.32mm]
T11  Test_point  [Test_point_1.32mm]
T12  Test_point  [Test_point_1.32mm]
U1  AD8616ARZ  [ADI-R-8_N]  (parts A,B of 2)
U2  LT1167AIS8#PBF  [LT-S8-8_N]
U3  AD8616ARZ  [ADI-R-8_N]  (part A of 2)

### Ports
3.3V, DAC[0..5], DACASelect, DACBSelect, Vbridge, Vcomp1, Vcomp2, Vdd, Vread

### Nets
GND: BNC4.2(Y) C18.1 C19.1 C20.1 C21.2 C22.1 C23.2 C24.1 DACA1.9(~{CE}) DACA1.12(GND) DACA1.13(GND) DACB1.9(~{CE}) DACB1.12(GND) DACB1.13(GND) H1.1 H2.1 H3.1 H4.1 LevelTr1.7(GND) R11.1(TOP) R12.1 U1.4(-V) U2.4(-VS) U2.5(REF) U3.4(-V)
3.3V: C20.2 LevelTr1.1(Vcca) LevelTr1.8(OE) ; port 3.3V
DAC0: DACA1.8((MSB)_DB7) DACB1.8((MSB)_DB7)
DAC1: DACA1.7(DB6) DACB1.7(DB6)
DAC2: DACA1.6(DB5) DACB1.6(DB5)
DAC3: DACA1.5(DB4) DACB1.5(DB4)
DAC4: DACA1.4(DB3) DACB1.4(DB3)
DAC5: DACA1.3(DB2) DACB1.3(DB2)
DACASelect: DACA1.10(~{CS}) ; port DACASelect
DACBSelect: DACB1.10(~{CS}) ; port DACBSelect
Vcomp1: LevelTr1.2(A1) ; port Vcomp1
Vcomp2: LevelTr1.3(A2) ; port Vcomp2
Vdd: C18.2 C19.2 C21.1 C22.2 C23.1 C24.2 DACA1.11(+VCC) DACB1.11(+VCC) LevelTr1.14(Vccb) R11.3(BOT) U1.8(+V) U2.7(+VS) U3.8(+V) ; port Vdd
NetBNC4_1: BNC4.1(X) P19.2
NetDACA1_14: DACA1.14(VOUT_SELECT) DACA1.15(VOUT_SENSE) DACA1.16(VOUT) R16.1 T10.1 U2.3(+IN)
NetDACB1_14: DACB1.14(VOUT_SELECT) DACB1.15(VOUT_SENSE) DACB1.16(VOUT) T12.1 U3.2(-IN_A)
NetLevelTr1_12: LevelTr1.12(B2) T8.1 U3.1(OUT_A)
NetLevelTr1_13: LevelTr1.13(B1) T6.1 U1.7(OUT_B)
NetMUX6_22: P18.1 P19.1 P20.1 ; port Vread
NetP18_2: P18.2 R14.2(TAP) T5.1 U1.6(-IN_B)
NetP20_2: P20.2 R16.2 T9.1 U2.2(-IN)
NetR10_1: R10.1 R12.2 T7.1 U1.5(+IN_B)
NetR10_2: R10.2 R14.3(BOT) U1.1(OUT_A) U1.2(-IN_A)
NetR11_2: R11.2(TAP) T4.1 U1.3(+IN_A) ; port Vbridge
NetR15_1: R15.1 U2.1(RG)
NetR15_2: R15.2 U2.8(RG)
NetT11_1: T11.1 U2.6(OUTPUT) U3.3(+IN_A)

Not connected (* = marked no-connect by the designer): DACA1 1((LSB)_DB0)* 2(DB1)*; DACB1 1((LSB)_DB0)* 2(DB1)*; LevelTr1 4(A3) 5(A4) 6(NC) 9(NC) 10(B4) 11(B3); R14 1(TOP)

### Buses and harness runs
bus DAC[0..5] = port DAC[0..5]

### Notes on the sheet
- Buffer for Vbridge
- Vbridge regulation
- Bridge for impedance discrimination
- Level traslator
  5V -> 3.3 V
- (near U1) Comparator
- (near R15) Rsense + INA
- Grounded holes
- (near DACA1) DAC for setting Vread
- (near U3) Comparator
- DAC for setting the threshold voltage
- ReRAM Board
- 1
- 6
- 7
- Armando Biscontini

### Library data of the parts
BNC4 = BNC: BNC Elbow Connector; LatestRevisionDate: 17-Jul-2002; LatestRevisionNote: Re-released for DXP Platform.; Publisher: Altium Limited
C18-C24 = Cap Semi: Capacitor (Semiconductor SIM Model); Published: 8-Jun-2000; LatestRevisionDate: 29-May-2009; LatestRevisionNote: IPC-7351 Footprint Added.; PackageReference: C1206; Publisher: Altium Limited; PackageDescription: Chip Capacitor
DACA1 DACB1 = AD558JNZ: Single 8-Bit Low Cost Complete uP-Compatible DACPORT, 0 to +70 degC, N-16, Pb-Free, Tube; Generic Part Number: AD558; Manufacturer: Analog Devices; # DAC Outputs: 1; Max V+: 16.5V; Op Pwr Diss: 375mW; Resolution (Bits): 8; Settling Time: 800ns; Single Supply: Yes; DatasheetVersion: Rev.A; PackageVersion: 070706-A; PackageReference: N-16; PackageDescription: 16-Lead Plastic Dual In-Line Package [PDIP] Narrow Body; Supplier 1: Digi-Key; Supplier Part Number 1: AD558JNZ-ND; Supplier 2: Farnell; Supplier Part Number 2: 1079362; Supplier 3: Farnell; Supplier Part Number 3: 1523778; Supplier 4: Newark; Supplier Part Number 4: 59K4249; Supplier 5: Mouser; Supplier Part Number 5: 584-AD558JNZ; Packing: Tube; RoHS: Y; Mounting Technology: Through Hole; Code_JEDEC: MS-001; PartNumber: AD558JNZ; ComponentLink1Description: Manufacturer URL; ComponentLink1URL: http://www.analog.com/en/index.html; ComponentLink2Description: Datasheet; ComponentLink2URL: http://www.analog.com/static/imported-files/data_sheets/AD558.pdf; ComponentLink3Description: Package Specification; ComponentLink3URL: http://www.analog.com/static/imported-files/packages/44768431550332N_16.pdf; ComponentLink4Description: Product URL; ComponentLink4URL: http://www.analog.com/en/digital-to-analog-converters/da-converters/ad558/products/product.html
H1-H4 = M3_hole: M3 hole
LevelTr1 = TXS0104E: Texas Instruments TXS0104E
P18-P20 = Header 2: Header, 2-Pin; LatestRevisionDate: 17-Jul-2002; LatestRevisionNote: Re-released for DXP Platform.; Publisher: Altium Limited
R10 R12 R15 R16 = Res3: Resistor; Published: 8-Jun-2000; LatestRevisionDate: 29-May-2009; LatestRevisionNote: IPC-7351 Footprint Added.; PackageReference: J1-0603; Publisher: Altium Limited; PackageDescription: Chip Resistor
R11 R14 = Trim_Bourns_3266W: as R13 on sheet RWcircuit_1; Published: 8-Jun-2000; LatestRevisionDate: 17-Jul-2002; LatestRevisionNote: Re-released for DXP Platform.; PackageReference: VR5; Publisher: Altium Limited; PackageDescription: Variable Resistor, Thru-Hole; 3 Leads
T4-T12 = Test_point_1.32mm: Test point 1.32mm
U1 U3 = AD8616ARZ: Double Channel Wide Bandwidth Operational Amplifier, 24 MHz BW, 12 V/us SR, Industrial, 8-pin SOIC (R-8), Tube; Generic Part Number: AD8616; Manufacturer: Analog Devices; Amplifiers Per Package: 2; Input Bias Current: 200fA; Input Offset Voltage: 23uV; Iq/Amp: 2mA; Slew Rate: 12V/us; Small Signal Bandwidth: 24MHz; V Span Max: 6V; V Span Min: 2.7V; DatasheetVersion: Rev. E; PackageVersion: 060506-A; PackageReference: R-8; PackageDescription: 8-Pin Standard Small Outline Package, Body 3.9 x 4.9 mm, Pitch 1.27 mm; Supplier 1: Digi-Key; Supplier Part Number 1: AD8616ARZ-ND; Supplier 2: Farnell; Supplier Part Number 2: 1581952; Supplier 3: Newark; Supplier Part Number 3: 19M0977; Mounting Technology: Surface Mount; Code_JEDEC: MS-012-AA; PartNumber: AD8616ARZ; ComponentLink1Description: Manufacturer URL; ComponentLink1URL: http://www.analog.com/en/index.html; ComponentLink2Description: Datasheet; ComponentLink2URL: http://www.analog.com/static/imported-files/data_sheets/AD8615_8616_8618.pdf; ComponentLink3Description: Package Specification; ComponentLink3URL: http://www.analog.com/static/imported-files/packages/PKG_PDF/SOIC_Narrow%20(R)/R_8.pdf
U2 = LT1167AIS8#PBF: Single Channel, Precision Operational Amplifier, Low Bias Current IA, 1 MHz Typical GBW, 1.2 V/us Typical SR, 4.6 to 40 V, 8-Pin SOIC (S8-8), Industrial, Pb-Free; Linear Technology Part Number: LT1167; Manufacturer: Linear Technology; Channels (#): 1; Is (mA) Typical: 0.9; SR (V/us) Typical: 1.2; Vos (mV) Typical: 0.015; Vs Max (V): 40; Vs Min (V): 4.6; DatasheetVersion: Rev. C; PackageVersion: Rev G; PackageReference: LT-S8-8; PackageDescription: 8-Pin Plastic Small Outline, Body 4.9 x 3.9 mm, Pitch 1.27 mm; Supplier 1: Digi-Key; Supplier Part Number 1: LT1167AIS8#PBF-ND; Supplier 2: Farnell; Supplier Part Number 2: 1663385; Supplier 3: Newark; Supplier Part Number 3: 57M2299; GBW (MHz) Typical: 1; RoHS: Pb-Free; Type: IA; Mounting Technology: Surface Mount; PartNumber: LT1167AIS8#PBF; ComponentLink1Description: Manufacturer URL; ComponentLink1URL: http://www.linear.com/; ComponentLink2Description: Datasheet; ComponentLink2URL: http://cds.linear.com/docs/en/datasheet/1167fc.pdf; ComponentLink3Description: Package Specification; ComponentLink3URL: http://cds.linear.com/docs/en/packaging/05081610_G_SO8.pdf

## Nets that join several sheets
GND: FPGA_board_and_power (28 pins), AddressingMuxes_1 (9 pins), AddressingMuxes_2 (9 pins), RWcircuit_1 (9 pins), MemoryChip (8 pins), RWcircuit_2 (25 pins)
3.3V: FPGA_board_and_power (C12.1 DC1.7 DC1.8 GR2.1), RWcircuit_2 (C20.2 LevelTr1.1 LevelTr1.8)
A0: FPGA_board_and_power (FPGA_Board1.44 P2.5), AddressingMuxes_1 (MUX1.17 MUX2.17 MUX3.17), AddressingMuxes_2 (MUX4.17 MUX5.17 MUX7.17)
A1: FPGA_board_and_power (FPGA_Board1.43 P2.6), AddressingMuxes_1 (MUX1.16 MUX2.16 MUX3.16), AddressingMuxes_2 (MUX4.16 MUX5.16 MUX7.16)
A2: FPGA_board_and_power (FPGA_Board1.42 P2.7), AddressingMuxes_1 (MUX1.15 MUX2.15 MUX3.15), AddressingMuxes_2 (MUX4.15 MUX5.15 MUX7.15)
A3: FPGA_board_and_power (FPGA_Board1.41 P2.8), AddressingMuxes_1 (MUX1.14 MUX2.14 MUX3.14), AddressingMuxes_2 (MUX4.14 MUX5.14 MUX7.14)
Cell0: AddressingMuxes_1 (MUX1.19), MemoryChip (P23.1 RR1.1)
Cell1: AddressingMuxes_1 (MUX1.20), MemoryChip (P23.2 RR1.2)
Cell2: AddressingMuxes_1 (MUX1.21), MemoryChip (P23.3 RR1.3)
Cell3: AddressingMuxes_1 (MUX1.22), MemoryChip (P23.5 RR1.5)
Cell4: AddressingMuxes_1 (MUX1.23), MemoryChip (P23.6 RR1.6)
Cell5: AddressingMuxes_1 (MUX1.24), MemoryChip (P23.7 RR1.7)
Cell6: AddressingMuxes_1 (MUX1.25), MemoryChip (P23.8 RR1.8)
Cell7: AddressingMuxes_1 (MUX1.26), MemoryChip (P23.9 RR1.9)
Cell8: AddressingMuxes_1 (MUX1.11), MemoryChip (P23.10 RR1.10)
Cell9: AddressingMuxes_1 (MUX1.10), MemoryChip (P23.11 RR1.11)
Cell10: AddressingMuxes_1 (MUX1.9), MemoryChip (P23.12 RR1.12)
Cell11: AddressingMuxes_1 (MUX1.8), MemoryChip (P23.13 RR1.13)
Cell12: AddressingMuxes_1 (MUX1.7), MemoryChip (P23.14 RR1.14)
Cell13: AddressingMuxes_1 (MUX1.6), MemoryChip (P23.15 RR1.15)
Cell14: AddressingMuxes_1 (MUX1.5), MemoryChip (P23.16 RR1.16)
Cell15: AddressingMuxes_1 (MUX1.4), MemoryChip (P23.17 RR1.17)
Cell16: AddressingMuxes_1 (MUX2.19), MemoryChip (P23.18 RR1.18)
Cell17: AddressingMuxes_1 (MUX2.20), MemoryChip (P23.19 RR1.19)
Cell18: AddressingMuxes_1 (MUX2.21), MemoryChip (P23.20 RR1.20)
Cell19: AddressingMuxes_1 (MUX2.22), MemoryChip (P23.21 RR1.21)
Cell20: AddressingMuxes_1 (MUX2.23), MemoryChip (P23.22 RR1.22)
Cell21: AddressingMuxes_1 (MUX2.24), MemoryChip (P23.23 RR1.23)
Cell22: AddressingMuxes_1 (MUX2.25), MemoryChip (P23.24 RR1.24)
Cell23: AddressingMuxes_1 (MUX2.26), MemoryChip (P23.25 RR1.25)
Cell24: AddressingMuxes_1 (MUX2.11), MemoryChip (P23.26 RR1.26)
Cell25: AddressingMuxes_1 (MUX2.10), MemoryChip (P23.27 RR1.27)
Cell26: AddressingMuxes_1 (MUX2.9), MemoryChip (P23.28 RR1.28)
Cell27: AddressingMuxes_1 (MUX2.8), MemoryChip (P23.29 RR1.29)
Cell28: AddressingMuxes_1 (MUX2.7), MemoryChip (P23.31 RR1.31)
Cell29: AddressingMuxes_1 (MUX2.6), MemoryChip (P23.32 RR1.32)
Cell30: AddressingMuxes_1 (MUX2.5), MemoryChip (P23.33 RR1.33)
Cell31: AddressingMuxes_1 (MUX2.4), MemoryChip (P23.34 RR1.34)
Cell32: AddressingMuxes_1 (MUX3.19), MemoryChip (P23.35 RR1.35)
Cell33: AddressingMuxes_1 (MUX3.20), MemoryChip (P23.36 RR1.36)
Cell34: AddressingMuxes_1 (MUX3.21), MemoryChip (P23.37 RR1.37)
Cell35: AddressingMuxes_1 (MUX3.22), MemoryChip (P23.38 RR1.38)
Cell36: AddressingMuxes_1 (MUX3.23), MemoryChip (P23.39 RR1.39)
Cell37: AddressingMuxes_1 (MUX3.24), MemoryChip (P23.40 RR1.40)
Cell38: AddressingMuxes_1 (MUX3.25), MemoryChip (P23.41 RR1.41)
Cell39: AddressingMuxes_1 (MUX3.26), MemoryChip (P23.42 RR1.42)
Cell40: AddressingMuxes_1 (MUX3.11), MemoryChip (P23.43 RR1.43)
Cell41: AddressingMuxes_1 (MUX3.10), MemoryChip (P23.44 RR1.44)
Cell42: AddressingMuxes_1 (MUX3.9), MemoryChip (P23.45 RR1.45)
Cell43: AddressingMuxes_1 (MUX3.8), MemoryChip (P23.46 RR1.46)
Cell44: AddressingMuxes_1 (MUX3.7), MemoryChip (P23.47 RR1.47)
Cell45: AddressingMuxes_1 (MUX3.6), MemoryChip (P23.48 RR1.48)
Cell46: AddressingMuxes_1 (MUX3.5), MemoryChip (P23.49 RR1.49)
Cell47: AddressingMuxes_1 (MUX3.4), MemoryChip (P23.50 RR1.50)
Cell48: AddressingMuxes_2 (MUX4.19), MemoryChip (P24.1 RR1.51)
Cell49: AddressingMuxes_2 (MUX4.20), MemoryChip (P24.2 RR1.52)
Cell50: AddressingMuxes_2 (MUX4.21), MemoryChip (P24.3 RR1.53)
Cell51: AddressingMuxes_2 (MUX4.22), MemoryChip (P24.4 RR1.54)
Cell52: AddressingMuxes_2 (MUX4.23), MemoryChip (P24.6 RR1.56)
Cell53: AddressingMuxes_2 (MUX4.24), MemoryChip (P24.7 RR1.57)
Cell54: AddressingMuxes_2 (MUX4.25), MemoryChip (P24.8 RR1.58)
Cell55: AddressingMuxes_2 (MUX4.26), MemoryChip (P24.9 RR1.59)
Cell56: AddressingMuxes_2 (MUX4.11), MemoryChip (P24.10 RR1.60)
Cell57: AddressingMuxes_2 (MUX4.10), MemoryChip (P24.11 RR1.61)
Cell58: AddressingMuxes_2 (MUX4.9), MemoryChip (P24.12 RR1.62)
Cell59: AddressingMuxes_2 (MUX4.8), MemoryChip (P24.13 RR1.63)
Cell60: AddressingMuxes_2 (MUX4.7), MemoryChip (P24.14 RR1.64)
Cell61: AddressingMuxes_2 (MUX4.6), MemoryChip (P24.15 RR1.65)
Cell62: AddressingMuxes_2 (MUX4.5), MemoryChip (P24.16 RR1.66)
Cell63: AddressingMuxes_2 (MUX4.4), MemoryChip (P24.17 RR1.67)
Cell64: AddressingMuxes_2 (MUX5.19), MemoryChip (P24.18 RR1.68)
Cell65: AddressingMuxes_2 (MUX5.20), MemoryChip (P24.19 RR1.69)
Cell66: AddressingMuxes_2 (MUX5.21), MemoryChip (P24.20 RR1.70)
Cell67: AddressingMuxes_2 (MUX5.22), MemoryChip (P24.21 RR1.71)
Cell68: AddressingMuxes_2 (MUX5.23), MemoryChip (P24.22 RR1.72)
Cell69: AddressingMuxes_2 (MUX5.24), MemoryChip (P24.23 RR1.73)
Cell70: AddressingMuxes_2 (MUX5.25), MemoryChip (P24.24 RR1.74)
Cell71: AddressingMuxes_2 (MUX5.26), MemoryChip (P24.25 RR1.75)
Cell72: AddressingMuxes_2 (MUX5.11), MemoryChip (P24.26 RR1.76)
Cell73: AddressingMuxes_2 (MUX5.10), MemoryChip (P24.27 RR1.77)
Cell74: AddressingMuxes_2 (MUX5.9), MemoryChip (P24.28 RR1.78)
Cell75: AddressingMuxes_2 (MUX5.8), MemoryChip (P24.29 RR1.79)
Cell76: AddressingMuxes_2 (MUX5.7), MemoryChip (P24.30 RR1.80)
Cell77: AddressingMuxes_2 (MUX5.6), MemoryChip (P24.32 RR1.82)
Cell78: AddressingMuxes_2 (MUX5.5), MemoryChip (P24.33 RR1.83)
Cell79: AddressingMuxes_2 (MUX5.4), MemoryChip (P24.34 RR1.84)
Cell80: AddressingMuxes_2 (MUX7.19), MemoryChip (P24.35 RR1.85)
Cell81: AddressingMuxes_2 (MUX7.20), MemoryChip (P24.36 RR1.86)
Cell82: AddressingMuxes_2 (MUX7.21), MemoryChip (P24.37 RR1.87)
Cell83: AddressingMuxes_2 (MUX7.22), MemoryChip (P24.38 RR1.88)
Cell84: AddressingMuxes_2 (MUX7.23), MemoryChip (P24.39 RR1.89)
Cell85: AddressingMuxes_2 (MUX7.24), MemoryChip (P24.40 RR1.90)
Cell86: AddressingMuxes_2 (MUX7.25), MemoryChip (P24.41 RR1.91)
Cell87: AddressingMuxes_2 (MUX7.26), MemoryChip (P24.42 RR1.92)
Cell88: AddressingMuxes_2 (MUX7.11), MemoryChip (P24.43 RR1.93)
Cell89: AddressingMuxes_2 (MUX7.10), MemoryChip (P24.44 RR1.94)
Cell90: AddressingMuxes_2 (MUX7.9), MemoryChip (P24.45 RR1.95)
Cell91: AddressingMuxes_2 (MUX7.8), MemoryChip (P24.46 RR1.96)
Cell92: AddressingMuxes_2 (MUX7.7), MemoryChip (P24.47 RR1.97)
Cell93: AddressingMuxes_2 (MUX7.6), MemoryChip (P24.48 RR1.98)
Cell94: AddressingMuxes_2 (MUX7.5), MemoryChip (P24.49 RR1.99)
Cell95: AddressingMuxes_2 (MUX7.4), MemoryChip (P24.50 RR1.100)
DAC0: FPGA_board_and_power (FPGA_Board1.9 P1.9), RWcircuit_2 (DACA1.8 DACB1.8)
DAC1: FPGA_board_and_power (FPGA_Board1.10 P1.10), RWcircuit_2 (DACA1.7 DACB1.7)
DAC2: FPGA_board_and_power (FPGA_Board1.11 P1.11), RWcircuit_2 (DACA1.6 DACB1.6)
DAC3: FPGA_board_and_power (FPGA_Board1.12 P1.12), RWcircuit_2 (DACA1.5 DACB1.5)
DAC4: FPGA_board_and_power (FPGA_Board1.13 P1.13), RWcircuit_2 (DACA1.4 DACB1.4)
DAC5: FPGA_board_and_power (FPGA_Board1.14 P1.14), RWcircuit_2 (DACA1.3 DACB1.3)
DACASelect: FPGA_board_and_power (FPGA_Board1.7 P1.7), RWcircuit_2 (DACA1.10)
DACBSelect: FPGA_board_and_power (FPGA_Board1.8 P1.8), RWcircuit_2 (DACB1.10)
EnableRW: FPGA_board_and_power (FPGA_Board1.21 P1.21), RWcircuit_1 (MUX6.18)
ModeRW0: FPGA_board_and_power (FPGA_Board1.22 P1.22), RWcircuit_1 (MUX6.17)
ModeRW1: FPGA_board_and_power (FPGA_Board1.23 P1.23), RWcircuit_1 (MUX6.16)
NetMUX1_28: AddressingMuxes_1 (MUX1.28 MUX2.28 MUX3.28), AddressingMuxes_2 (MUX4.28 MUX5.28 MUX7.28), RWcircuit_1 (MUX6.28)
NetMUX6_22: RWcircuit_1 (MUX6.22), RWcircuit_2 (P18.1 P19.1 P20.1)
S0: FPGA_board_and_power (FPGA_Board1.40 P2.9), AddressingMuxes_1 (MUX1.18)
S1: FPGA_board_and_power (FPGA_Board1.39 P2.10), AddressingMuxes_1 (MUX2.18)
S2: FPGA_board_and_power (FPGA_Board1.38 P2.11), AddressingMuxes_1 (MUX3.18)
S3: FPGA_board_and_power (FPGA_Board1.37 P2.12), AddressingMuxes_2 (MUX4.18)
S4: FPGA_board_and_power (FPGA_Board1.36 P2.13), AddressingMuxes_2 (MUX5.18)
S5: FPGA_board_and_power (FPGA_Board1.35 P2.14), AddressingMuxes_2 (MUX7.18)
Vcomp1: FPGA_board_and_power (FPGA_Board1.1 P1.1), RWcircuit_2 (LevelTr1.2)
Vcomp2: FPGA_board_and_power (FPGA_Board1.2 P1.2), RWcircuit_2 (LevelTr1.3)
Vdd: FPGA_board_and_power (5 pins), AddressingMuxes_1 (6 pins), AddressingMuxes_2 (6 pins), RWcircuit_1 (C16.1 MUX6.1 P7.1 P9.1), RWcircuit_2 (13 pins)
Vss: FPGA_board_and_power (GR4.2 P4.2), AddressingMuxes_1 (6 pins), AddressingMuxes_2 (6 pins), RWcircuit_1 (C17.2 MUX6.27 P13.1)